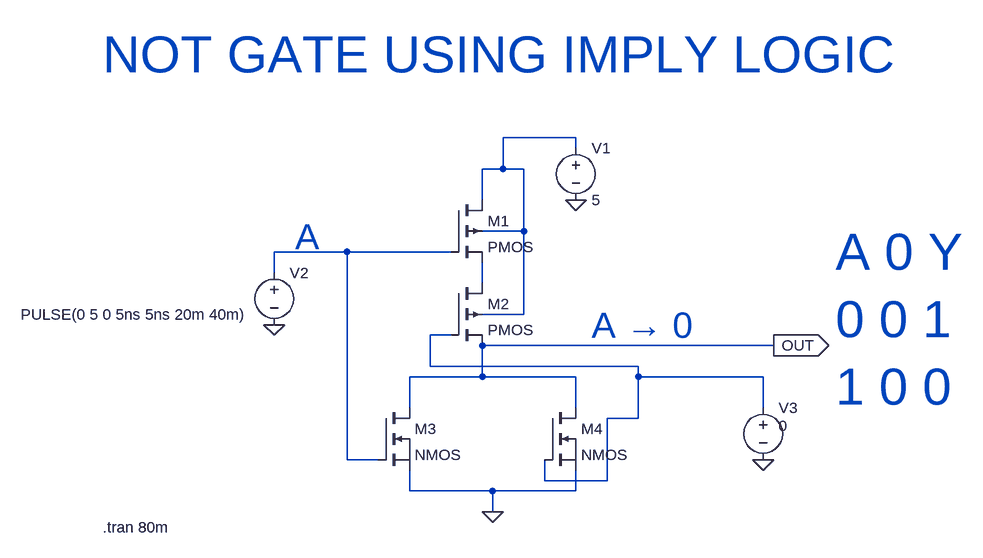
[diagram p0: schematic originalnotgateimply.asc]
originalnotgateimply.asc, the LTspice schematic file:
Version 4
SHEET 1 1096 680
WIRE 352 -80 240 -80
WIRE 352 -64 352 -80
WIRE 240 -32 240 -80
WIRE 240 -32 208 -32
WIRE 272 -32 240 -32
WIRE 208 16 208 -32
WIRE 272 64 272 -32
WIRE 272 64 208 64
WIRE 0 96 -112 96
WIRE 160 96 0 96
WIRE -112 128 -112 96
WIRE 208 144 208 112
WIRE 272 192 272 64
WIRE 272 192 208 192
WIRE 160 224 128 224
WIRE 656 240 208 240
WIRE 128 272 128 224
WIRE 448 272 128 272
WIRE 208 288 208 240
WIRE 208 288 96 288
WIRE 352 288 208 288
WIRE 448 288 448 272
WIRE 640 288 448 288
WIRE 96 336 96 288
WIRE 352 336 352 288
WIRE 640 336 640 288
WIRE 448 352 448 288
WIRE 448 352 400 352
WIRE 0 416 0 96
WIRE 48 416 0 416
WIRE 304 448 304 416
WIRE 400 448 400 352
WIRE 400 448 304 448
WIRE 96 464 96 432
WIRE 224 464 96 464
WIRE 352 464 352 432
WIRE 352 464 224 464
WIRE 224 496 224 464
FLAG 656 240 OUT
IOPIN 656 240 Out
FLAG 640 416 0
FLAG 224 496 0
FLAG -112 208 0
FLAG 352 16 0
SYMBOL nmos 48 336 R0
SYMATTR InstName M3
SYMBOL nmos 304 336 R0
SYMATTR InstName M4
SYMBOL pmos4 160 16 R0
SYMATTR InstName M1
SYMBOL pmos4 160 144 R0
SYMATTR InstName M2
SYMBOL voltage 352 -80 R0
WINDOW 123 0 0 Left 0
WINDOW 39 0 0 Left 0
SYMATTR InstName V1
SYMATTR Value 5
SYMBOL voltage -112 112 R0
WINDOW 123 0 0 Left 0
WINDOW 39 0 0 Left 0
WINDOW 3 -390 80 Left 2
SYMATTR InstName V2
SYMATTR Value PULSE(0 5 0 5ns 5ns 20m 40m)
SYMBOL voltage 640 320 R0
WINDOW 3 24 44 Left 2
WINDOW 123 0 0 Left 0
WINDOW 39 0 0 Left 0
SYMATTR Value 0
SYMATTR InstName V3
TEXT -80 72 Left 5 ;A
TEXT -376 -208 Left 6 ;NOT GATE USING IMPLY LOGIC
TEXT 376 208 Left 5 ;A → 0
TEXT 752 96 Left 6 ;A 0 Y\n0 0 1\n1 0 0
TEXT -376 520 Left 2 !.tran 80m

The netlist it stands for:
* originalnotgateimply.asc
M3 OUT N002 0 0 NMOS
M4 OUT N004 0 0 NMOS
M1 N001 N002 N003 N001 PMOS
M2 N003 N004 OUT N001 PMOS
V1 N001 0 5
V2 N002 0 PULSE(0 5 0 5ns 5ns 20m 40m)
V3 N004 0 0
.model NMOS NMOS
.model PMOS PMOS
.lib standard.mos
* A
* NOT GATE USING IMPLY LOGIC
* A → 0
* A 0 Y
* 0 0 1
* 1 0 0
.tran 80m
.backanno
.end